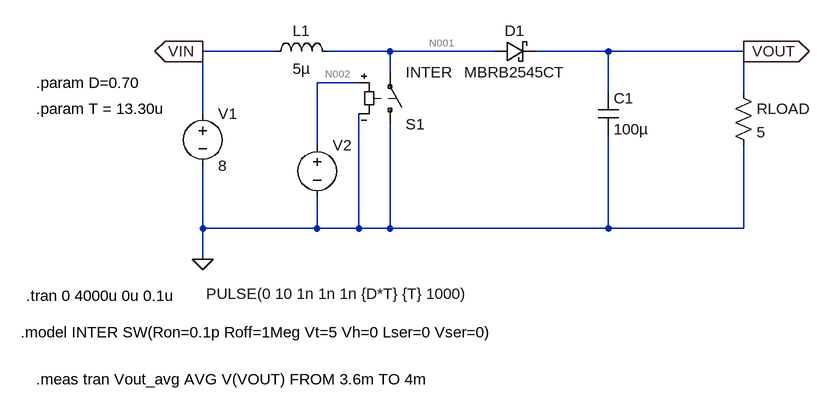
[diagram p0: schematic POE2025Week12StepUp_new.asc]
POE2025Week12StepUp_new.asc, the LTspice schematic file:
Version 4.1
SHEET 1 1312 680
WIRE 80 64 -32 64
WIRE 256 64 160 64
WIRE 416 64 256 64
WIRE 592 64 480 64
WIRE 800 64 592 64
WIRE 256 96 256 64
WIRE 208 112 144 112
WIRE 592 128 592 64
WIRE 800 128 800 64
WIRE -32 160 -32 64
WIRE 144 208 144 112
WIRE -32 336 -32 240
WIRE 144 336 144 288
WIRE 144 336 -32 336
WIRE 208 336 208 160
WIRE 208 336 144 336
WIRE 256 336 256 176
WIRE 256 336 208 336
WIRE 592 336 592 192
WIRE 592 336 256 336
WIRE 800 336 800 208
WIRE 800 336 592 336
WIRE -32 384 -32 336
FLAG -32 384 0
FLAG 800 64 VOUT
IOPIN 800 64 Out
FLAG -32 64 VIN
IOPIN -32 64 Out
SYMBOL voltage -32 144 R0
WINDOW 123 0 0 Left 2
WINDOW 39 0 0 Left 2
SYMATTR InstName V1
SYMATTR Value 8
SYMBOL voltage 144 192 R0
WINDOW 3 -171 245 Left 2
WINDOW 123 0 0 Left 2
WINDOW 39 0 0 Left 2
SYMATTR Value PULSE(0 10 1n 1n 1n {D*T} {T} 1000)
SYMATTR InstName V2
SYMBOL ind 64 80 R270
WINDOW 0 32 56 VTop 2
WINDOW 3 5 56 VBottom 2
SYMATTR InstName L1
SYMATTR Value 5µ
SYMBOL cap 576 128 R0
SYMATTR InstName C1
SYMATTR Value 100µ
SYMBOL res 784 112 R0
SYMATTR InstName RLOAD
SYMATTR Value 5
SYMBOL schottky 416 80 R270
WINDOW 0 32 32 VTop 2
WINDOW 3 0 32 VBottom 2
SYMATTR InstName D1
SYMATTR Value MBRB2545CT
SYMBOL sw 256 192 M180
SYMATTR InstName S1
SYMATTR Value INTER
TEXT -304 440 Left 2 !.tran 0 4000u 0u 0.1u
TEXT -312 496 Left 2 !.model INTER SW(Ron=0.1p Roff=1Meg Vt=5 Vh=0 Lser=0 Vser=0)
TEXT -288 112 Left 2 !.param D=0.70
TEXT -288 152 Left 2 !.param T = 13.30u
TEXT -288 568 Left 2 !.meas tran Vout_avg AVG V(VOUT) FROM 3.6m TO 4m

The netlist it stands for:
* POE2025Week12StepUp_new.asc
V1 VIN 0 8
V2 N002 0 PULSE(0 10 1n 1n 1n {D*T} {T} 1000)
L1 VIN N001 5µ
C1 VOUT 0 100µ
RLOAD VOUT 0 5
D1 N001 VOUT MBRB2545CT
S1 0 N001 N002 0 INTER
.model D D
.lib standard.dio
.tran 0 4000u 0u 0.1u
.model INTER SW(Ron=0.1p Roff=1Meg Vt=5 Vh=0 Lser=0 Vser=0)
.param D=0.70
.param T = 13.30u
.meas tran Vout_avg AVG V(VOUT) FROM 3.6m TO 4m
.backanno
.end

* Results of the author's LTspice run, read from the files saved beside the schematic
* Operating Point, zero values left out:
*   V(vout) = 7.638 V
*   V(vin) = 8 V
*   V(n001) = 7.998 V
*   I(V1) = -1.528 A
*   I(RLOAD) = 1.528 A
*   I(L1) = 1.528 A
*   I(D1) = 1.528 A
*   I(S1) = 7.998 µA
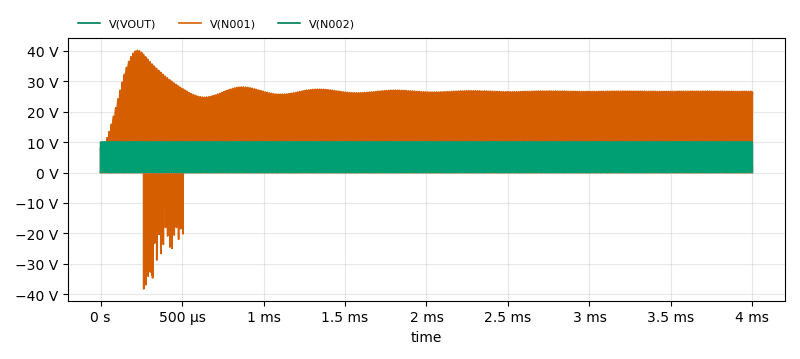
[diagram p1: Transient Analysis of POE2025Week12StepUp_new.asc, plotted from the saved traces]
* Transient Analysis, 1 run:
*   V(VOUT): min 7.497 V, max 39.58 V, average 26.3 V, rms 26.53 V, last 25.88 V
*   V(N001): min -38.28 V, max 40.21 V, average 7.949 V, rms 14.76 V, last 26.5 V
*   V(N002): min 0 V, max 10 V, average 7.007 V, rms 8.37 V, last 0 V
* From the log:
*   Vout_avg: AVG(V(VOUT))=26.0213366564 FROM 0.0036 TO 0.004